# EAGLE design data_proV2.0 - A (EAGLE 8.0.1)
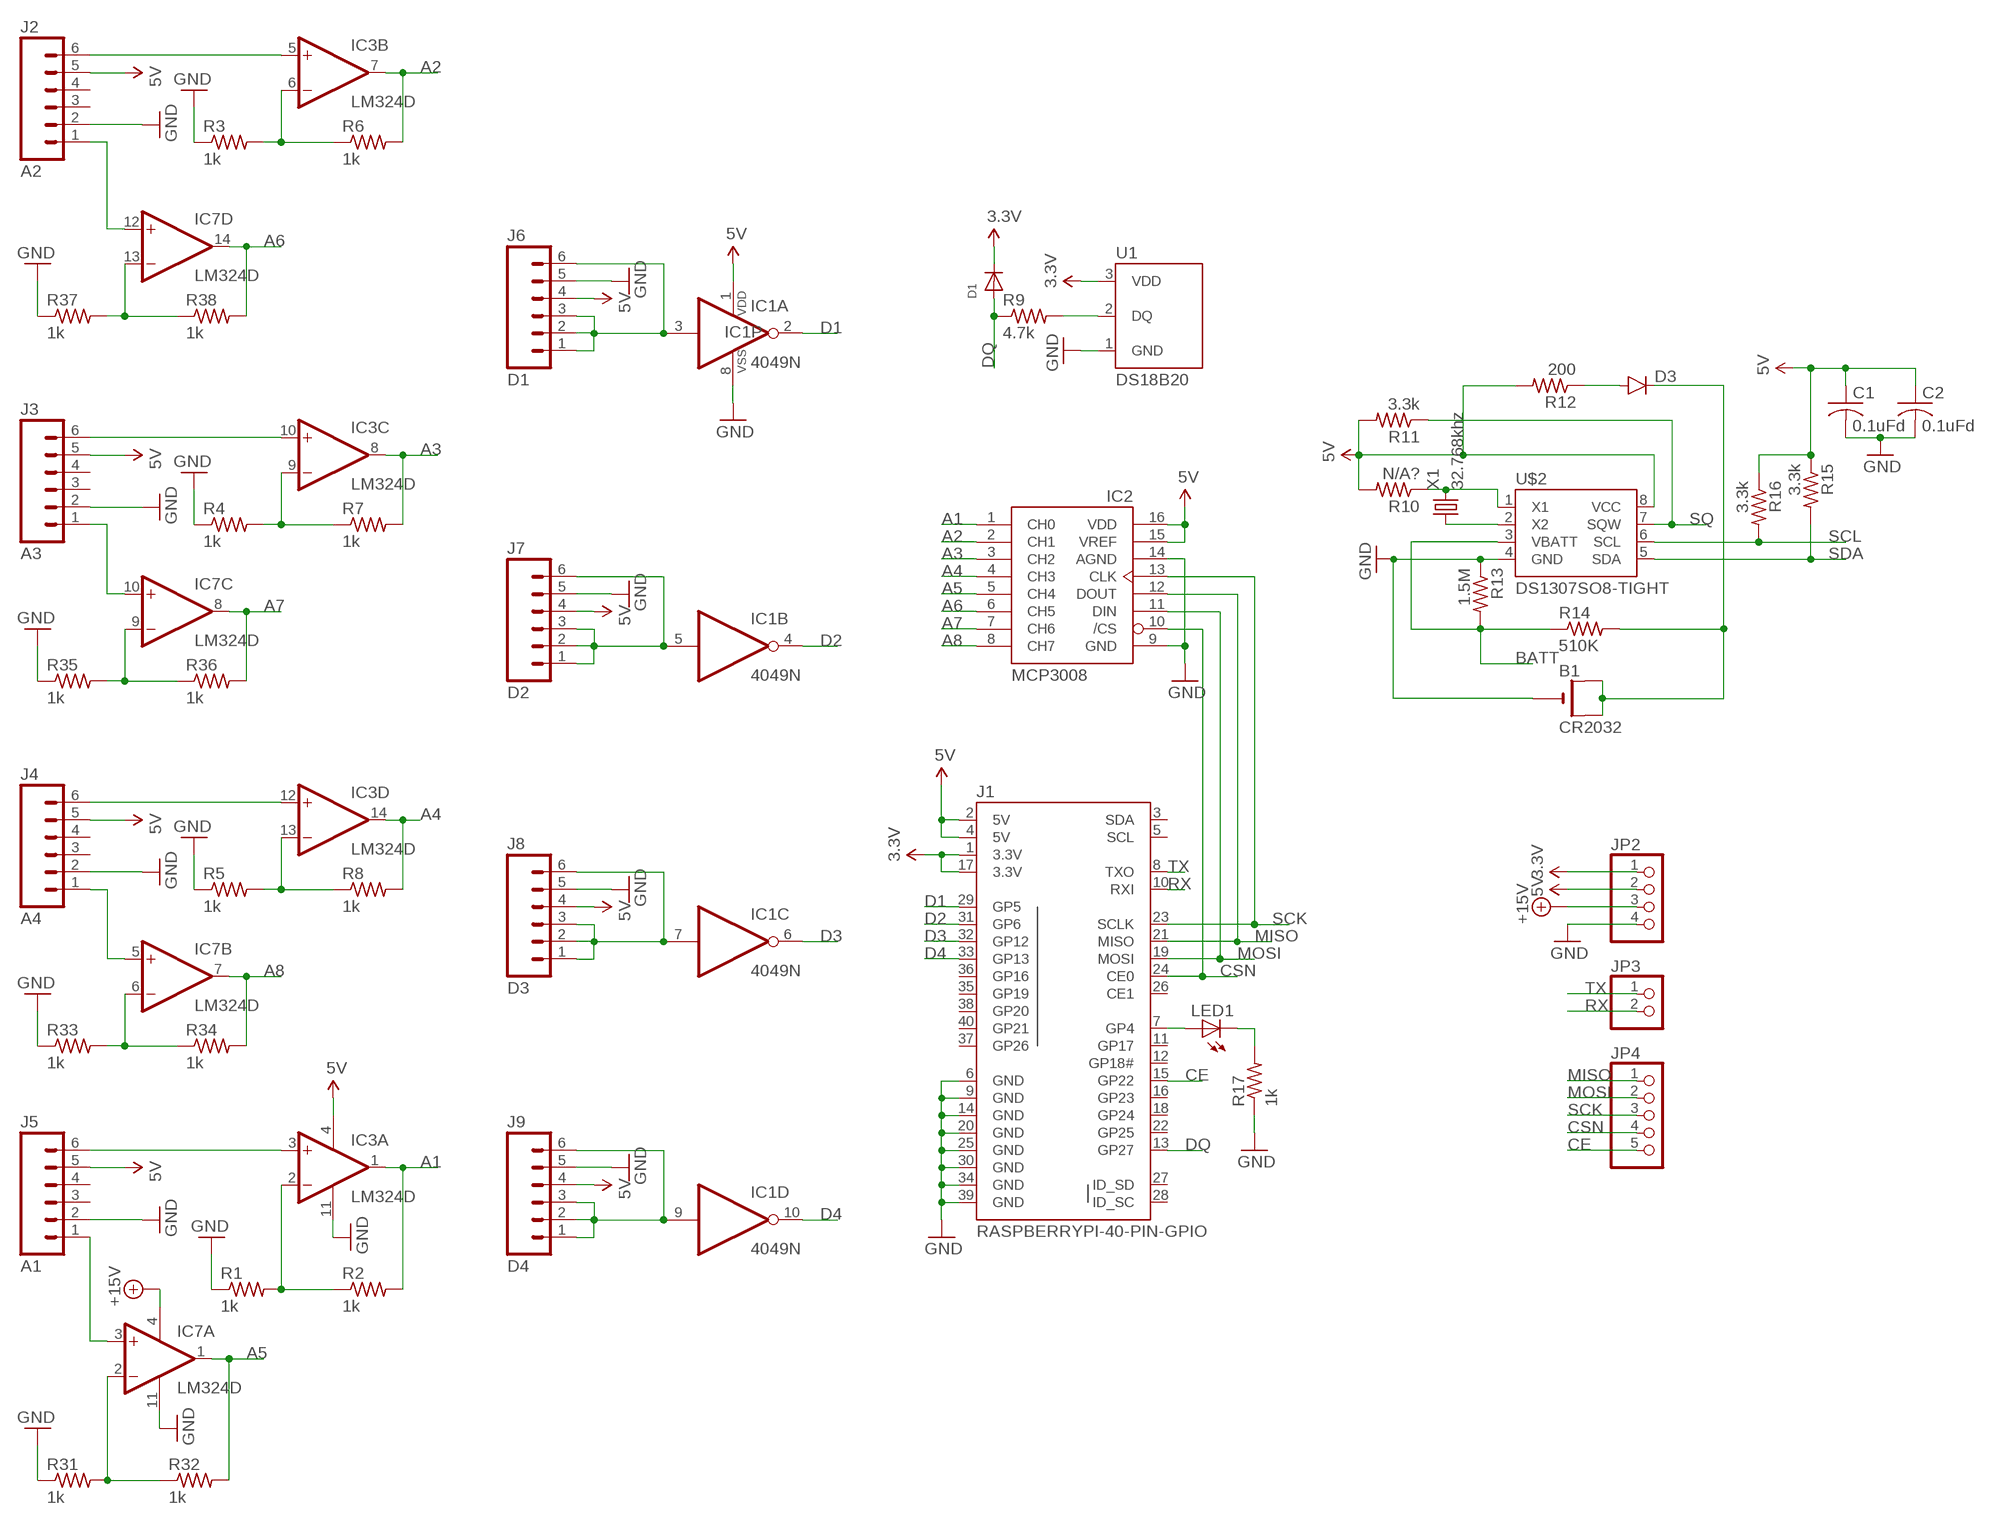
[diagram p0: schematic, sheet 1]

## Parts
B1  CR2032  CR2032SMT  [CR2032-SMD]
C1  0.1uFd  C-USC0805  [C0805]
C2  0.1uFd  C-USC0805  [C0805]
D1  DIODESOD-323F  [SOD-323F]
D3  DIODESMB  [SMB-DIODE]
IC1  4049N  [DIL16]
IC2  MCP3008  [DIL16]
IC3  LM324D  [SO14]
IC7  LM324D  [SO14]
J1  RASPBERRYPI-40-PIN-GPIO  [2X20-SHROUDED]
J2  A2  M06VERNIER-ANALOG  [BTA]
J3  A3  M06VERNIER-ANALOG  [BTA]
J4  A4  M06VERNIER-ANALOG  [BTA]
J5  A1  M06VERNIER-ANALOG  [BTA]
J6  D1  M06VERNIER-DIGITAL  [BTD]
J7  D2  M06VERNIER-DIGITAL  [BTD]
J8  D3  M06VERNIER-DIGITAL  [BTD]
J9  D4  M06VERNIER-DIGITAL  [BTD]
JP2  PINHD-1X4  [1X04]
JP3  PINHD-1X2  [1X02]
JP4  PINHD-1X5  [1X05]
LED1  LEDCHIP-LED0805  [CHIP-LED0805]
R1  1k  R-US_R0805  [R0805]
R2  1k  R-US_R0805  [R0805]
R3  1k  R-US_R0805  [R0805]
R4  1k  R-US_R0805  [R0805]
R5  1k  R-US_R0805  [R0805]
R6  1k  R-US_R0805  [R0805]
R7  1k  R-US_R0805  [R0805]
R8  1k  R-US_R0805  [R0805]
R9  4.7k  R-US_R0805  [R0805]
R10  N/A?  R-US_R0805  [R0805]
R11  3.3k  R-US_R0805  [R0805]
R12  200  R-US_R0805  [R0805]
R13  1.5M  R-US_R0805  [R0805]
R14  510K  R-US_R0805  [R0805]
R15  3.3k  R-US_R0805  [R0805]
R16  3.3k  R-US_R0805  [R0805]
R17  1k  R-US_R0805  [R0805]
R31  1k  R-US_R0805  [R0805]
R32  1k  R-US_R0805  [R0805]
R33  1k  R-US_R0805  [R0805]
R34  1k  R-US_R0805  [R0805]
R35  1k  R-US_R0805  [R0805]
R36  1k  R-US_R0805  [R0805]
R37  1k  R-US_R0805  [R0805]
R38  1k  R-US_R0805  [R0805]
U1  DS18B20  [TO-92-AMMO]
U$2  DS1307SO8-TIGHT  [SO08-TIGHT]
X1  32.768khz  CRYSTALTC38H  [TC38H]

## Nets
3.3V: D1.C J1.1(3.3V) J1.17(3.3V) JP2.1 U1.3(VDD)
5V: C1.1 C2.1 IC1.1(P:VDD) IC2.15(VREF) IC2.16(VDD) IC3.4(P:V+) J1.2(5V) J1.4(5V) J2.5 J3.5 J4.5 J5.5 J6.4 J7.4 J8.4 J9.4 JP2.2 R10.2 R11.2 R12.2 R15.1 R16.1 U$2.8(VCC)
+15V: IC7.4(P:V+) JP2.3
A1: IC2.1(CH0) IC3.1(A:OUT) R2.2
A2: IC2.2(CH1) IC3.7(B:OUT) R6.2
A3: IC2.3(CH2) IC3.8(C:OUT) R7.2
A4: IC2.4(CH3) IC3.14(D:OUT) R8.2
A5: IC2.5(CH4) IC7.1(A:OUT) R32.2
A6: IC2.6(CH5) IC7.14(D:OUT) R38.2
A7: IC2.7(CH6) IC7.8(C:OUT) R36.2
A8: IC2.8(CH7) IC7.7(B:OUT) R34.2
BATT: R13.2 R14.1 U$2.3(VBATT)
CE: J1.15(GP22) JP4.5
CSN: IC2.10(/CS) J1.24(CE0) JP4.4
D1: IC1.2(A:O) J1.29(GP5)
D2: IC1.4(B:O) J1.31(GP6)
D3: IC1.6(C:O) J1.32(GP12)
D4: IC1.10(D:O) J1.33(GP13)
DQ: D1.A J1.13(GP27) R9.1
GND: B1.- C1.2 C2.2 IC1.8(P:VSS) IC2.9(GND) IC2.14(AGND) IC3.11(P:V-) IC7.11(P:V-) J1.6(GND) J1.9(GND) J1.14(GND) J1.20(GND) J1.25(GND) J1.30(GND) J1.34(GND) J1.39(GND) J2.2 J3.2 J4.2 J5.2 J6.5 J7.5 J8.5 J9.5 JP2.4 R1.1 R3.1 R4.1 R5.1 R13.1 R17.1 R31.1 R33.1 R35.1 R37.1 U1.1(GND) U$2.4(GND)
MISO: IC2.12(DOUT) J1.21(MISO) JP4.1
MOSI: IC2.11(DIN) J1.19(MOSI) JP4.2
N$1: U$2.2(X2) X1.1
N$2: R10.1 U$2.1(X1) X1.2
N$3: B1.+$1(+) B1.+$2(+1) D3.C R14.2
N$4: J1.7(GP4) LED1.A
N$5: IC3.2(A:-IN) R1.2 R2.1
N$6: R9.2 U1.2(DQ)
N$7: IC3.13(D:-IN) R5.2 R8.1
N$8: IC3.6(B:-IN) R3.2 R6.1
N$10: D3.A R12.1
N$11: IC1.3(A:I) J6.1 J6.2 J6.3 J6.6
N$12: IC1.5(B:I) J7.1 J7.2 J7.3 J7.6
N$14: IC1.7(C:I) J8.1 J8.2 J8.3 J8.6
N$15: IC1.9(D:I) J9.1 J9.2 J9.3 J9.6
N$16: IC3.9(C:-IN) R4.2 R7.1
N$17: LED1.C R17.2
N$30: IC3.3(A:+IN) J5.6
N$31: IC7.2(A:-IN) R31.2 R32.1
N$32: IC7.3(A:+IN) J5.1
N$33: IC7.6(B:-IN) R33.2 R34.1
N$34: IC7.9(C:-IN) R35.2 R36.1
N$35: IC7.13(D:-IN) R37.2 R38.1
N$36: IC7.12(D:+IN) J2.1
RX: J1.10(RXI) JP3.2
S1-5V1: IC3.5(B:+IN) J2.6
S1-5V2: IC3.10(C:+IN) J3.6
S1-5V3: IC7.5(B:+IN) J4.1
S1-5V4: IC3.12(D:+IN) J4.6
S1-5V5: IC7.10(C:+IN) J3.1
SCK: IC2.13(CLK) J1.23(SCLK) JP4.3
SCL: R16.2 U$2.6(SCL)
SDA: R15.2 U$2.5(SDA)
SQ: R11.1 U$2.7(SQW)
TX: J1.8(TXO) JP3.1
Unconnected: IC1.11(E:I) IC1.12(E:O) IC1.14(F:I) IC1.15(F:O) J1.3(SDA) J1.5(SCL) J1.11(GP17) J1.12(GP18#) J1.16(GP23) J1.18(GP24) J1.22(GP25) J1.26(CE1) J1.27(ID_SD) J1.28(ID_SC) J1.35(GP19) J1.36(GP16) J1.37(GP26) J1.38(GP20) J1.40(GP21) J2.3 J2.4 J3.3 J3.4 J4.3 J4.4 J5.3 J5.4

## Library data of the parts
B1 = adafruit:CR2032
C1 C2 = resistor:C-US: CAPACITOR, American symbol
D1 = adafruit:DIODE: Diode
D3 = SparkFun-DiscreteSemi:DIODE: Diode; PROD_ID: DIO-09646
IC1 = 40xx:4049: Hex inverting BUFFER
IC2 = adafruit:MCP3008
IC3 IC7 = linear:LM324: OP AMP
J1 = SparkFun-Boards:RASPBERRYPI-40-PIN-GPIO: Second Generation Raspberry Pi GPIO Header 2x20 pin connector, as found on B, B+, A+ models.
J2-J9 = SparkFun-Connectors:M06: Header 6 Standard 6-pin 0.1" header. Use with straight break away headers (SKU : PRT-00116), right angle break away headers (PRT-00553), swiss pins (PRT-00743), machine pins (PRT-00117), and female headers (PRT-00115). Molex polarized connector foot print use with SKU : PRT-08094 with associated crimp pins and housings. NOTES ON THE VARIANTS LOCK and LOCK_LONGPADS... This footprint was designed to help hold the alignment of a through-hole component (i.e. 6-pin header) while soldering it into place. You may notice that each hole has been shifted either up or down by 0.005 of an inch from it's more standard position (which is a perfectly straight line). This slight alteration caused the pins (the squares in the middle) to touch the edges of the holes. Because they are alternating, it causes a "brace" to hold the component in place. 0.005 has proven to be the perfect amount of "off-center" position when using our standard breakaway headers. Although looks a little odd when you look at the bare footprint, once you have a header in there, the alteration is very hard to notice. Also,if you push a header all the way into place, it is covered up entirely on the bottom side. This idea of altering the position of holes to aid alignment will be further integrated into the Sparkfun Library for other footprints. It can help hold any component with 3 or more connection pins.
JP2 = pinhead:PINHD-1X4: PIN HEADER
JP3 = pinhead:PINHD-1X2: PIN HEADER
JP4 = pinhead:PINHD-1X5: PIN HEADER
LED1 = led:LED: LED OSRAM: - CHIPLED LG R971, LG N971, LY N971, LG Q971, LY Q971, LO R971, LY R971 LH N974, LH R974 LS Q976, LO Q976, LY Q976 LO Q996 - Hyper CHIPLED LW Q18S LB Q993, LB Q99A, LB R99A - SideLED LS A670, LO A670, LY A670, LG A670, LP A670 LB A673, LV A673, LT A673, LW A673 LH A674 LY A675 LS A676, LA A676, LO A676, LY A676, LW A676 LS A679, LY A679, LG A679 - Hyper Micro SIDELED® LS Y876, LA Y876, LO Y876, LY Y876 LT Y87S - SmartLED LW L88C, LW L88S LB L89C, LB L89S, LG L890 LS L89K, LO L89K, LY L89K LS L896, LA L896, LO L896, LY L896 - TOPLED LS T670, LO T670, LY T670, LG T670, LP T670 LSG T670, LSP T670, LSY T670, LOP T670, LYG T670 LG T671, LOG T671, LSG T671 LB T673, LV T673, LT T673, LW T673 LH T674 LS T676, LA T676, LO T676, LY T676, LB T676, LH T676, LSB T676, LW T676 LB T67C, LV T67C, LT T67C, LS T67K, LO T67K, LY T67K, LW E67C LS E67B, LA E67B, LO E67B, LY E67B, LB E67C, LV E67C, LT E67C LW T67C LS T679, LY T679, LG T679 LS T770, LO T770, LY T770, LG T770, LP T770 LB T773, LV T773, LT T773, LW T773 LH T774 LS E675, LA E675, LY E675, LS T675 LS T776, LA T776, LO T776, LY T776, LB T776 LHGB T686 LT T68C, LB T68C - Hyper Mini TOPLED® LB M676 - Mini TOPLED Santana® LG M470 LS M47K, LO M47K, LY M47K Source: http://www.osram.convergy.de LUXEON: - LUMILED® LXK2-PW12-R00, LXK2-PW12-S00, LXK2-PW14-U00, LXK2-PW14-V00 LXK2-PM12-R00, LXK2-PM12-S00, LXK2-PM14-U00 LXK2-PE12-Q00, LXK2-PE12-R00, LXK2-PE12-S00, LXK2-PE14-T00, LXK2-PE14-U00 LXK2-PB12-K00, LXK2-PB12-L00, LXK2-PB12-M00, LXK2-PB14-N00, LXK2-PB14-P00, LXK2-PB14-Q00 LXK2-PR12-L00, LXK2-PR12-M00, LXK2-PR14-Q00, LXK2-PR14-R00 LXK2-PD12-Q00, LXK2-PD12-R00, LXK2-PD12-S00 LXK2-PH12-R00, LXK2-PH12-S00 LXK2-PL12-P00, LXK2-PL12-Q00, LXK2-PL12-R00 Source: www.luxeon.com KINGBRIGHT: KA-3528ASYC Source: www.kingbright.com
R1-R9 R31-R38 = resistor:R-US_: RESISTOR, American symbol
R10-R17 = adafruit:R-US_: RESISTOR, American symbol
U1 = SparkFun-Sensors:DS18B20: Dallas/Maxim DS18B20 1-wire temperature sensor Datasheet: http://datasheets.maximintegrated.com/en/ds/DS18B20.pdf temp thermometer 1-wire one-wire one wire; STORE_ID: SEN-00245
U$2 = SparkFun-FreqCtrl:DS1307: I2C real-time clock with battery backup.; PROD_ID: IC-08138
X1 = crystal:CRYSTAL: CRYSTAL; OC_FARNELL: unknown; OC_NEWARK: unknown

## Board
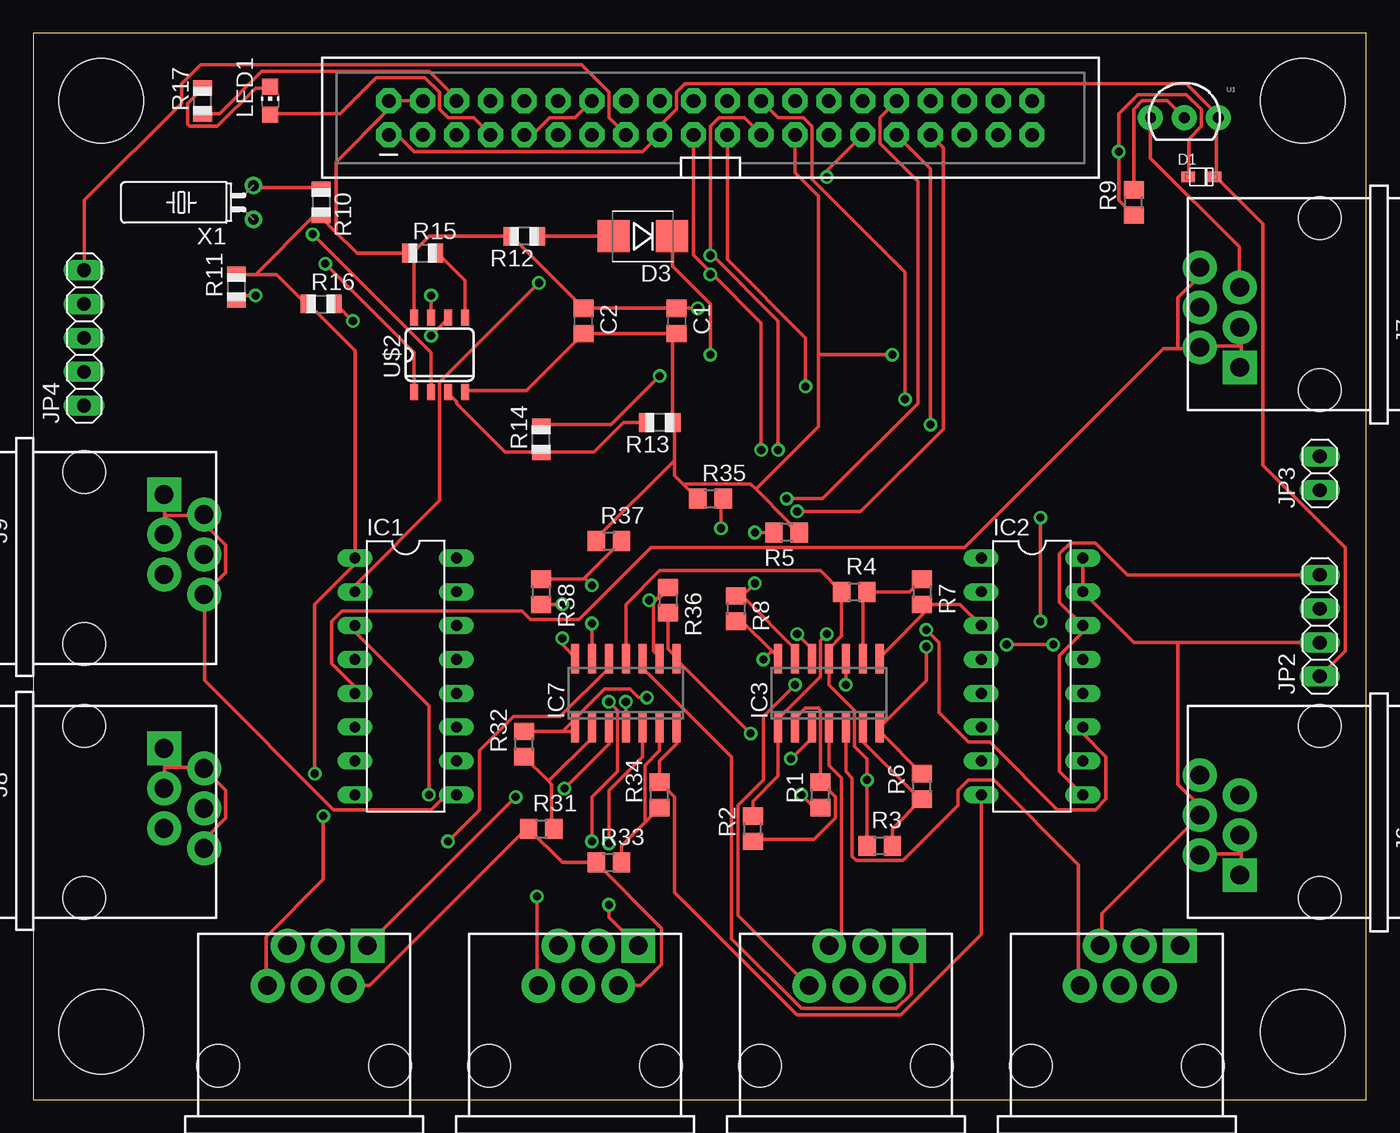
[diagram p1: board, top side]
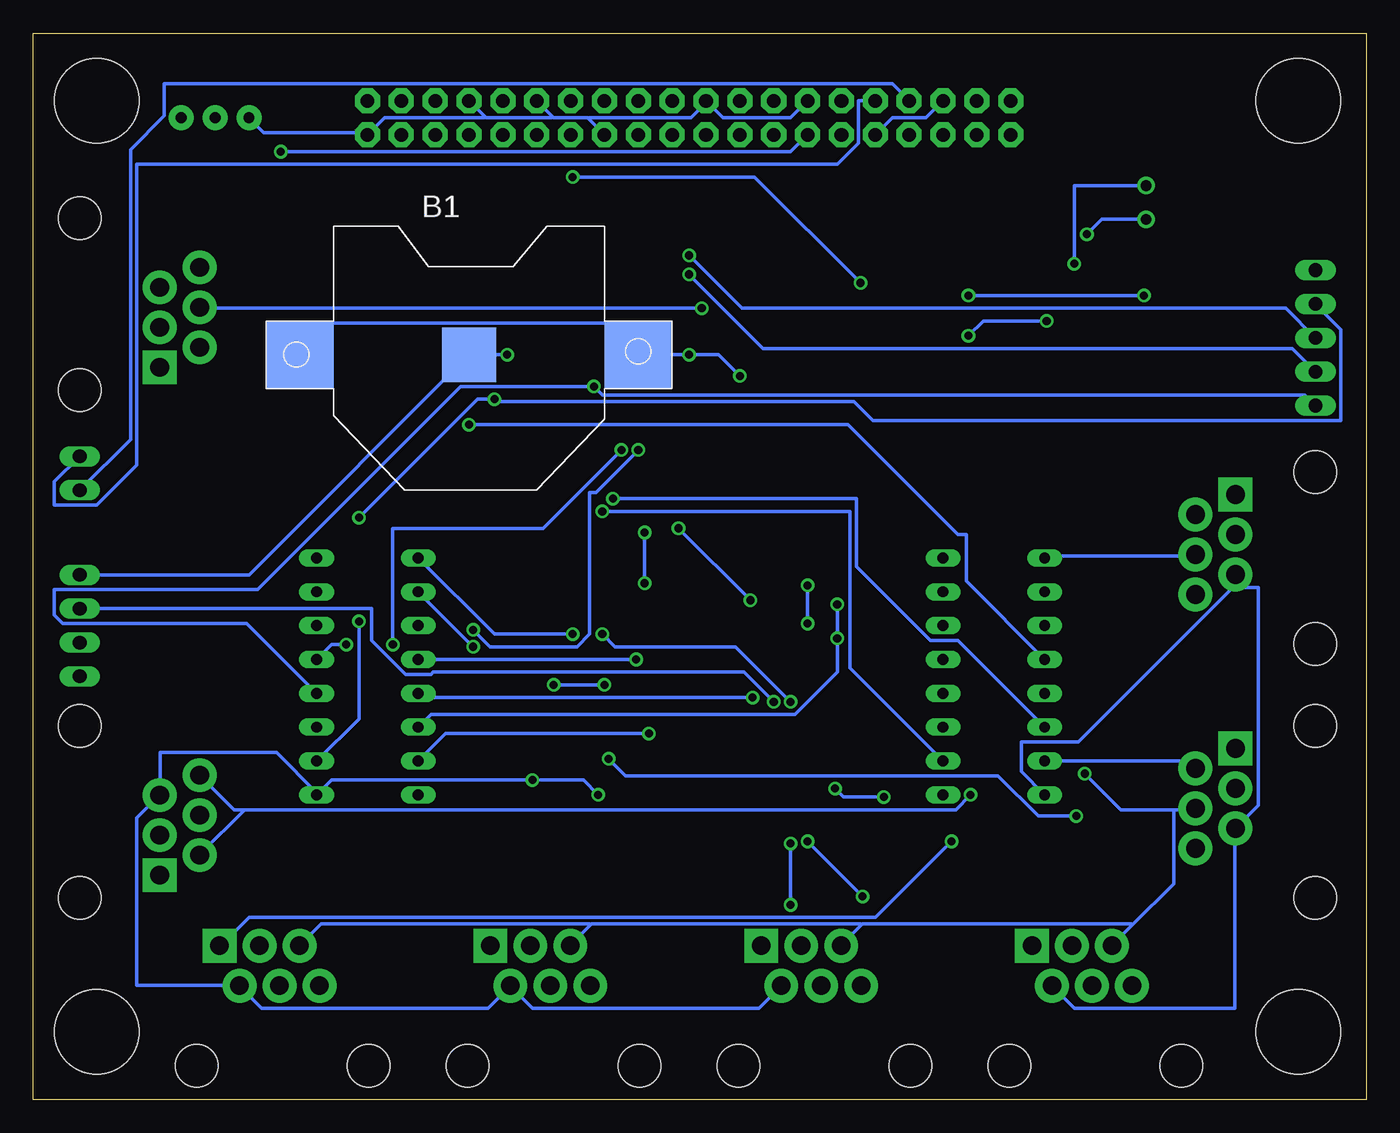
[diagram p2: board, bottom side, seen from below]

Size 100 x 80 mm. Coordinates in mm from the lower left corner, seen from the top.
Outline: 0,0 100,0 100,80 0,80 0,0
Copper layers (1*16): Top 0.035mm / dielectric 1.5mm / Bottom 0.035mm
Design rules "default": minimum track width 10mil, minimum drill 24mil, track to track 8mil, track to pad 8mil, pad to pad 8mil, via to via 8mil, smd to smd 8mil, copper to edge 40mil, drill to drill 8mil, minimum pad ring 10mil, minimum via ring 8mil, stop-mask expansion 4mil, vias tented up to drill 0mil, thermal gap 10mil
Holes 6.35 mm at 5.08,5.08 95.25,5.08 95.25,74.93 5.08,74.93

### Footprints (pad centres in the part's own frame; a part is rotated, then mirrored left to right if it is on the bottom)
CR2032-SMD = smd 5.08 x 5.08: +$1 -12.7,0; +$2 12.7,0 | smd 4.064 x 4.064: - 0,0
C0805 = smd 1.3 x 1.5: 1 -0.95,0; 2 0.95,0
SOD-323F = smd 1 x 0.8: A -1,0; C 1,0
SMB-DIODE = smd 2.4 x 2.4: A 2.2,0; C -2.2,0
DIL16 = drill 0.813 long: 1 -8.89,-3.81; 2 -6.35,-3.81; 3 -3.81,-3.81; 4 -1.27,-3.81; 5 1.27,-3.81; 6 3.81,-3.81; 7 6.35,-3.81; 8 8.89,-3.81; 9 8.89,3.81; 10 6.35,3.81; 11 3.81,3.81; 12 1.27,3.81; 13 -1.27,3.81; 14 -3.81,3.81; 15 -6.35,3.81; 16 -8.89,3.81
SO14 = smd 0.6 x 2.2: 1 -3.81,-2.6; 2 -2.54,-2.6; 3 -1.27,-2.6; 4 0,-2.6; 5 1.27,-2.6; 6 2.54,-2.6; 7 3.81,-2.6; 8 3.81,2.6; 9 2.54,2.6; 10 1.27,2.6; 11 0,2.6; 12 -1.27,2.6; 13 -2.54,2.6; 14 -3.81,2.6
2X20-SHROUDED = drill 1.016 pad 1.88 octagon: 1 -1.27,24.13; 2 1.27,24.13; 3 -1.27,21.59; 4 1.27,21.59; 5 -1.27,19.05; 6 1.27,19.05; 7 -1.27,16.51; 8 1.27,16.51; 9 -1.27,13.97; 10 1.27,13.97; 11 -1.27,11.43; 12 1.27,11.43; 13 -1.27,8.89; 14 1.27,8.89; 15 -1.27,6.35; 16 1.27,6.35; 17 -1.27,3.81; 18 1.27,3.81; 19 -1.27,1.27; 20 1.27,1.27; 21 -1.27,-1.27; 22 1.27,-1.27; 23 -1.27,-3.81; 24 1.27,-3.81; 25 -1.27,-6.35; 26 1.27,-6.35; 27 -1.27,-8.89; 28 1.27,-8.89; 29 -1.27,-11.43; 30 1.27,-11.43; 31 -1.27,-13.97; 32 1.27,-13.97; 33 -1.27,-16.51; 34 1.27,-16.51; 35 -1.27,-19.05; 36 1.27,-19.05; 37 -1.27,-21.59; 38 1.27,-21.59; 39 -1.27,-24.13; 40 1.27,-24.13
BTA = drill 1.4 pad 2.54 square: 1 4.75,9 | drill 1.4 pad 2.54: 2 3.25,6; 3 1.75,9; 4 0.25,6; 5 -1.25,9; 6 -2.75,6 | hole 3.2: 6.45,0; -6.45,0
BTD = drill 1.4 pad 2.54 square: 1 -4.75,6 | drill 1.4 pad 2.54: 2 -3.25,9; 3 -1.75,6; 4 -0.25,9; 5 1.25,6; 6 2.75,9 | hole 3.2: 6.45,0; -6.45,0
1X04 = drill 1.016 long: 1 -3.81,0; 2 -1.27,0; 3 1.27,0; 4 3.81,0
1X02 = drill 1.016 long: 1 -1.27,0; 2 1.27,0
1X05 = drill 1.016 long: 1 -5.08,0; 2 -2.54,0; 3 0,0; 4 2.54,0; 5 5.08,0
CHIP-LED0805 = smd 1.2 x 1.2: A 0,-1.05; C 0,1.05
R0805 = smd 1.3 x 1.5: 1 -0.95,0; 2 0.95,0
R0805' = smd 1.1 x 1.4: 1 -1,0; 2 1,0
TO-92-AMMO = drill 0.813 pad 1.88: 1 -2.54,0; 2 0,0; 3 2.54,0
SO08-TIGHT = smd 0.6 x 1.2: 1 -1.905,-2.8; 2 -0.635,-2.8; 3 0.635,-2.8; 4 1.905,-2.8; 5 1.905,2.8; 6 0.635,2.8; 7 -0.635,2.8; 8 -1.905,2.8
TC38H = drill 0.813: 1 -1.27,0; 2 1.27,0

### Placement (x,y rotation side)
B1  67.31,55.88 0 bottom
C1  48.26,58.42 270 top
C2  41.27,58.42 270 top
D1  87.63,69.22 0 top
D3  45.72,64.77 180 top
IC1  27.94,31.75 270 top
IC2  74.93,31.75 270 top
IC3  59.69,30.48 0 top
IC7  44.45,30.48 0 top
J1  50.8,73.66 90 top
J2  81.28,2.54 0 top
J3  60.96,2.54 0 top
J4  40.64,2.54 0 top
J5  20.32,2.54 0 top
J6  96.52,21.59 90 top
J7  96.52,59.69 90 top
J8  3.81,21.59 270 top
J9  3.81,40.64 270 top
JP2  96.52,35.56 90 top
JP3  96.52,46.99 90 top
JP4  3.81,57.15 90 top
LED1  17.78,74.93 0 top
R1  59.05,22.86 90 top
R2  53.98,20.32 90 top
R3  63.5,19.05 0 top
R4  61.59,38.1 0 top
R5  56.52,42.55 180 top
R6  66.67,23.5 90 top
R7  66.67,38.1 270 top
R8  52.7,36.83 270 top
R9  82.55,67.31 90 top
R10  N/A?  [R0805']  21.59,67.31 270 top
R11  3.3k  [R0805']  15.24,60.96 90 top
R12  200  [R0805']  36.83,64.77 180 top
R13  1.5M  [R0805']  46.99,50.8 180 top
R14  510K  [R0805']  38.1,49.53 90 top
R15  3.3k  [R0805']  29.21,63.5 0 top
R16  3.3k  [R0805']  21.59,59.69 0 top
R17  1k  [R0805']  12.7,74.93 90 top
R31  38.1,20.32 0 top
R32  36.83,26.67 90 top
R33  43.18,17.78 0 top
R34  46.99,22.86 90 top
R35  50.8,45.09 0 top
R36  47.62,37.47 270 top
R37  43.18,41.91 0 top
R38  38.1,38.1 270 top
U1  86.36,73.66 0 top
U$2  30.48,55.88 0 top
X1  16.51,67.31 90 top

### Tracks (layer width: path | path; a pad name or v marks a point on that pad's centre or on a via)
3.3V
  Top 0.254: J1.1 27.3,72.39 28.57,71.12 45.72,71.12 J1.17 46.99,73.03 48.26,74.3 48.26,75.56 48.9,76.2 86.52,76.2 88.74,73.98 88.74,73.66 U1.3 88.74,73.5 88.74,69.22 | JP2.1 98.42,33.66 98.42,41.43 92.23,47.62 92.23,65.72 88.74,69.22 | 88.74,69.22 D1.C
5V  (via drill 0.61)
  Top 0.254: J1.4 J1.2 26.67,74.3 22.7,70.33 22.7,65.25 22.62,65.17 | U$2.8 28.57,63.18 28.26,63.5 R15.1 | 16.67,61.91 18.26,61.91 20.48,59.69 R16.1 20.64,59.69 24.13,56.2 IC1.1 24.13,40.16 21.11,37.15 v21.11,24.45 | 16.67,61.91 15.24,61.91 R11.2 | 21.59,66.2 20.95,66.2 16.67,61.91 | R15.1 24.29,63.5 22.62,65.17 | 21.59,66.2 22.62,65.17 | 21.59,66.2 R10.2 | C2.1 35.88,64.77 R12.2 29.69,64.77 28.42,63.5 R15.1 | C2.1 C1.1 | C2.1 | C1.1 v49.85,59.37 | C1.1 | J2.5 80.17,11.59 80.17,13.97 87.47,21.27 J6.4 87.47,21.43 87.47,22.07 85.88,23.65 85.88,34.29 | IC2.16 IC2.15 82.55,34.29 85.88,34.29 | 85.88,34.29 JP2.2 | IC3.4 59.69,25.08 60.64,24.13 60.64,12.38 59.85,11.59 J3.5
  Bottom 0.254: IC1.1 23.97,40.8 12.86,40.8 J9.4 | v49.85,59.37 87.47,59.37 J7.4 | 17.54,13.1 14.45,16.19 14.45,21.75 | 17.54,13.1 19.05,11.59 J5.5 | 14.45,21.75 12.86,21.75 J8.4 | 37.86,13.1 37.78,13.18 17.62,13.18 17.54,13.1 | 37.86,13.1 39.37,11.59 J4.5 | 58.18,13.1 58.1,13.18 37.94,13.18 37.86,13.1 | 58.18,13.1 59.69,11.59 J3.5 | J2.5 80.01,11.59 78.42,13.18 58.26,13.18 58.18,13.1 | v21.11,24.45 18.41,21.75 14.45,21.75
+15V  (via drill 0.61)
  Top 0.254: v44.45,29.84 IC7.4
  Bottom 0.254: v44.45,29.84 46.67,32.07 70.01,32.07 70.17,31.91 72.07,31.91 74.61,34.45 74.61,36.83 JP2.3
A1  (via drill 0.61)
  Top 0.254: R2.2 53.98,22.38 55.88,24.29 IC3.1 55.88,28.57 59.05,31.75 59.05,34.45 v59.53,34.92
  Bottom 0.254: IC2.1 65.41,34.92 v59.53,34.92
A2  (via drill 0.61)
  Top 0.254: R6.2 63.5,27.62 IC3.7 63.5,27.94 66.99,31.43 v66.99,33.97
  Bottom 0.254: v66.99,33.97 IC2.2
A3
  Top 0.254: 67.47,37.15 69.53,37.15 IC2.3 | 67.47,37.15 R7.2 | 67.47,37.15 63.5,33.18 IC3.8
A4  (via drill 0.61)
  Top 0.254: 55.4,33.66 55.88,33.18 IC3.14 | 55.4,33.66 53.18,35.88 R8.2 | 55.4,33.66 v54.77,33.02
  Bottom 0.254: v54.77,33.02 IC2.4
A5  (via drill 0.61)
  Top 0.254: 39.69,27.62 40.48,27.62 40.64,27.78 IC7.1 | 39.69,27.62 R32.2 | v46.04,30.16 45.4,30.16 44.77,30.8 42.86,30.8 39.69,27.62
  Bottom 0.254: IC2.5 70.8,30.16 v46.04,30.16
A6  (via drill 0.61)
  Top 0.254: v39.69,37.15 R38.2 | v39.69,34.61 39.69,34.13 40.64,33.18 IC7.14
  Bottom 0.254: v39.69,37.15 v39.69,34.61 39.69,32.07 42.86,28.89 70.17,28.89 IC2.6
A7  (via drill 0.61)
  Top 0.254: R36.2 47.62,33.81 48.26,33.18 IC7.8 48.26,33.02 v53.82,27.46
  Bottom 0.254: IC2.7 69.06,27.46 v53.82,27.46
A8
  Top 0.254: R34.2 46.99,25.4 48.26,26.67 IC7.7 | IC2.8 71.12,12.38 65.09,6.35 57.31,6.35 48.1,15.56 48.1,22.7 R34.2 | R34.2
BATT
  Top 0.254: 38.1,48.58 35.4,48.58 31.75,52.23 31.75,52.39 31.11,53.02 U$2.3 | R13.2 44.29,50.8 42.07,48.58 38.1,48.58 | 38.1,48.58 R14.1
CE
  Top 0.254: JP4.5 3.81,67.47 11.11,74.77 11.11,76.2 12.54,77.63 41.12,77.63 43.18,75.56 43.18,73.66 J1.15
CSN  (via drill 0.61)
  Top 0.254: v75.56,43.66 v75.56,35.88 | v65.41,52.55 65.41,62.07 58.42,69.06 58.42,73.03 57.78,73.66 55.88,73.66 J1.24
  Bottom 0.254: IC2.10 75.56,28.57 v75.56,35.88 | v75.56,43.66 66.67,52.55 v65.41,52.55 65.25,52.39 38.42,52.39 36.99,50.96 1.91,50.96 1.91,57.78 JP4.4
D1  (via drill 0.61)
  Top 0.254: IC1.2 24.13,38.58 30.48,44.93 30.48,53.82 v37.94,61.28 | v59.53,69.22 59.53,69.69 J1.29
  Bottom 0.254: v37.94,61.28 45.88,69.22 v59.53,69.22
D2  (via drill 0.61)
  Top 0.254: v67.31,50.64 67.31,69.85 J1.31
  Bottom 0.254: IC1.4 30,38.89 30,42.39 30.64,42.39 38.89,50.64 v67.31,50.64
D3  (via drill 0.61)
  Top 0.254: v56.52,45.09 59.21,45.09 66.36,52.23 66.36,68.9 63.5,71.75 63.5,73.66 J1.32
  Bottom 0.254: IC1.6 30.64,34.45 32.7,34.45 38.26,40.01 38.26,45.09 v56.52,45.09
D4  (via drill 0.61)
  Top 0.254: v57.31,44.13 62.07,44.13 68.26,50.32 68.26,71.44 J1.33
  Bottom 0.254: IC1.10 38.73,32.38 38.73,44.13 v57.31,44.13
DQ  (via drill 0.61)
  Top 0.254: D1.A 86.68,69.22 86.68,72.07 87.63,73.03 87.63,74.3 86.52,75.41 82.87,75.41 81.44,73.98 v81.44,71.12 81.44,67.47 R9.1
  Bottom 0.254: J1.13 43.18,71.12 v81.44,71.12
GND  (via drill 0.61)
  Top 0.254: C2.2 36.99,53.18 32.38,53.18 U$2.4 | C2.2 47.94,57.47 | 47.94,57.47 C1.2 47.94,57.47 | C2.2 | 48.1,47.94 48.1,46.83 48.82,46.12 | 48.1,47.94 48.1,50.8 R13.1 47.94,50.8 47.94,57.47 | 48.82,46.12 R35.1 | 48.1,47.94 42.39,42.23 42.39,41.91 R37.1 | 54.21,45.8 53.82,46.2 48.9,46.2 48.82,46.12 | 54.21,45.8 56.67,43.34 56.67,43.18 57.31,42.55 R5.1 | J1.6 31.75,75.09 29.69,77.15 17.14,77.15 13.97,73.98 12.7,73.98 R17.1 | U1.1 83.82,70.64 90.49,63.98 90.49,60.96 J7.5 | J1.9 37.47,72.39 38.73,73.66 40.64,73.66 J1.14 | 54.21,45.8 58.9,50.48 58.9,55.88 | 58.9,55.88 58.9,67.79 57.15,69.53 J1.25 | R3.1 v62.55,23.97 62.55,25.56 61.59,26.51 61.59,29.21 59.69,31.11 IC3.11 59.69,33.81 60.64,34.77 R4.1 | IC7.11 44.45,37.15 46.99,39.69 59.05,39.69 R4.1 | R4.1 | v57.63,22.86 58.42,22.07 59.05,22.07 R1.1 | IC2.9 76.99,24.61 76.99,33.34 78.74,35.08 IC2.14 76.99,37.31 76.99,40.96 77.79,41.75 79.69,41.75 82.07,39.37 JP2.4 | R33.1 39.69,17.78 R31.1 37.15,20.16 36.83,20.16 25.24,8.57 23.65,8.57 J5.2 | R33.1 47.15,12.86 47.15,10.16 45.56,8.57 43.97,8.57 J4.2 | R33.1 | v64.45,55.88 58.9,55.88
  Bottom 0.254: J1.9 35.56,73.66 33.02,73.66 J1.6 | J1.14 43.18,73.66 48.26,73.66 J1.20 49.53,74.77 50.64,73.66 58.26,73.66 58.34,73.58 | 58.34,73.58 58.42,73.66 60.96,73.66 61.04,73.74 | 58.34,73.58 J1.25 | J1.30 61.04,73.74 | 66.12,73.74 66.04,73.66 61.12,73.66 61.04,73.74 | 66.12,73.74 J1.34 | 66.12,73.74 66.2,73.66 73.66,73.66 J1.39 74.93,72.55 82.71,72.55 U1.1 | v57.63,22.86 58.74,23.97 v62.55,23.97 77.63,23.97 IC2.9 78.74,23.02 81.76,26.04 90.49,26.04 90.49,22.86 J6.5 90.65,22.7 92.23,21.11 92.23,8.57 84.61,8.57 J2.2 84.45,8.41 82.87,6.83 65.88,6.83 64.29,8.41 J3.2 64.14,8.41 62.55,6.83 45.56,6.83 43.97,8.41 J4.2 | JP2.4 83.82,39.37 B1.- v64.45,55.88 | IC1.8 25.88,24.61 25.88,26.83 21.59,26.83 9.84,38.58 9.84,39.37 J9.5 9.84,38.42 8.1,38.42 8.1,22.07 9.68,20.48 J8.5 9.84,20.32 9.84,6.83 21.91,6.83 23.5,8.41 J5.2
MISO  (via drill 0.61)
  Top 0.254: v57.94,53.5 57.94,57.15 52.07,63.02 J1.21
  Bottom 0.254: IC2.12 83.98,35.72 97.79,35.72 98.42,36.35 98.42,38.26 83.19,38.26 67.94,53.5 v57.94,53.5 57.31,52.86 4.6,52.86 JP4.1
MOSI  (via drill 0.61)
  Top 0.254: IC2.11 78.74,27.46 80.49,25.72 80.49,22.54 79.69,21.75 76.83,21.75 71.75,26.83 70.17,26.83 67.94,29.05 67.94,34.29 v66.99,35.24 | v54.61,48.74 54.61,58.26 50.88,61.99 | 50.88,61.99 49.53,63.34 J1.19 | v50.8,61.91 50.88,61.99
  Bottom 0.254: v66.99,35.24 65.72,33.97 59.21,33.97 58.26,34.92 58.26,45.56 57.78,45.56 v54.61,48.74 | JP4.2 5.56,56.36 45.24,56.36 v50.8,61.91
N$1  (via drill 0.61)
  Top 0.254: U$2.2 29.84,56.04 v20.95,64.93
  Bottom 0.254: v20.95,64.93 19.84,66.04 X1.1
N$2  (via drill 0.61)
  Top 0.254: U$2.1 28.57,56.04 v21.91,62.71 | X1.2 16.67,68.42 21.59,68.42 R10.1
  Bottom 0.254: v21.91,62.71 21.91,68.58 X1.2
N$3  (via drill 0.61)
  Top 0.254: v46.99,54.29 43.34,50.64 38.1,50.64 R14.2 | v50.8,55.88 50.8,59.69 47.94,62.55 47.94,64.77 D3.C
  Bottom 0.254: v46.99,54.29 48.58,55.88 v50.8,55.88 B1.+$2 56.99,58.26 77.63,58.26 B1.+$1
N$4
  Top 0.254: J1.7 33.02,73.66 31.11,73.66 30.48,74.3 30.48,75.56 29.37,76.68 25.72,76.68 23.02,73.98 17.78,73.98 LED1.A
N$5
  Top 0.254: R1.2 60.17,22.7 60.17,21.11 58.58,19.53 53.98,19.53 R2.1 | IC3.2 57.15,28.57 57.94,29.37 58.9,29.37 59.05,29.21 R1.2 | R1.2
N$6
  Top 0.254: R9.2 82.55,74.3 83.19,74.93 85.09,74.93 U1.2
N$7  (via drill 0.61)
  Top 0.254: 53.02,37.62 53.34,37.62 57.15,33.81 IC3.13 | 53.02,37.62 52.7,37.62 R8.1 53.02,37.62 | v54.13,42.55 R5.2 | 53.02,37.62 v54.13,38.73
  Bottom 0.254: v54.13,38.73 v54.13,42.55
N$8
  Top 0.254: R3.2 64.45,20.32 R6.1 66.52,22.54 62.23,26.83 IC3.6
N$10
  Top 0.254: D3.A R12.1
N$11  (via drill 0.61)
  Top 0.254: 90.65,18.41 90.65,19.68 J6.3 | 90.65,18.41 90.65,16.99 J6.1 | 90.65,18.41 87.63,18.41 J6.2 | IC1.3 24.13,35.08 29.69,29.53 v29.69,22.86
  Bottom 0.254: v29.69,22.86 30.8,21.75 84.14,21.75 | 84.14,21.75 84.93,21.75 87.47,24.29 J6.6 | 84.14,21.75 87.47,18.41 J6.2
N$12
  Top 0.254: 90.65,56.52 90.65,57.78 J7.3 | 90.65,56.52 90.65,55.09 J7.1 | IC1.5 24.13,30.96 22.38,32.7 22.38,35.88 23.18,36.67 36.67,36.67 37.31,36.04 40.96,36.04 46.35,41.43 69.85,41.43 84.77,56.36 85.88,56.36 | 85.88,56.36 87.47,56.36 J7.2 87.63,56.52 90.65,56.52 | 85.88,56.36 85.88,60.17 87.47,61.75 87.47,62.39 J7.6
N$14
  Top 0.254: 9.84,24.92 9.84,26.19 J8.1 | 9.84,24.92 9.84,23.5 J8.3 | J8.6 12.86,18.89 12.86,19.53 14.45,21.11 14.45,23.18 12.86,24.77 J8.2 12.7,24.92 9.84,24.92
  Bottom 0.254: IC1.7 13.34,25.4 12.86,24.92 J8.2
N$15
  Top 0.254: 9.84,43.81 9.84,45.24 J9.1 | 9.84,43.81 9.84,42.55 J9.3 | 9.84,43.81 12.7,43.81 J9.2 12.86,43.81 12.86,43.18 14.45,41.59 14.45,39.53 12.86,37.94 J9.6 12.86,37.78 12.86,31.43 22.54,21.75 29.84,21.75 30.96,22.86 IC1.9
N$16
  Top 0.254: R7.1 65.72,38.1 R4.2 62.39,38.1 62.23,37.94 IC3.9
N$17
  Top 0.254: LED1.C 17.78,75.88 16.67,75.88 13.81,73.03 11.75,73.03 11.59,73.18 11.59,74.77 12.7,75.88 R17.2
N$30  (via drill 0.61)
  Top 0.254: IC3.3 58.42,27.15 v56.83,25.56 | v21.75,21.27 21.75,16.51 17.46,12.22 17.46,8.57 J5.6
  Bottom 0.254: v56.83,25.56 55.56,24.29 27.62,24.29 24.61,21.27 v21.75,21.27
N$31
  Top 0.254: 38.66,23.89 R32.1 | 38.66,23.89 38.89,23.65 38.89,20.32 R31.2 | IC7.2 41.91,27.15 38.66,23.89
N$32  (via drill 0.61)
  Top 0.254: IC7.3 43.18,26.67 v39.85,23.34 | v36.2,22.7 25.08,11.59 J5.1
  Bottom 0.254: v39.85,23.34 39.21,22.7 v36.2,22.7
N$33
  Top 0.254: 45.96,20.88 R34.1 | 45.96,20.88 44.13,19.05 R33.2 | IC7.6 46.99,26.19 45.88,25.08 45.88,20.95 45.96,20.88
N$34  (via drill 0.61)
  Top 0.254: 46.59,37.39 46.51,37.31 46.51,33.66 46.99,33.18 IC7.9 | 46.59,37.39 46.83,37.62 46.99,37.62 47.62,38.26 R36.1 | v51.59,42.86 51.59,45.09 R35.2 | v46.2,37.47 46.51,37.47 46.59,37.39
  Bottom 0.254: v46.2,37.47 v51.59,42.86
N$35  (via drill 0.61)
  Top 0.254: 41.35,39.13 R37.2 | 41.35,39.13 41.27,39.05 R38.1 | v41.91,35.72 IC7.13 | 41.35,39.13 v41.91,38.58
  Bottom 0.254: v41.91,38.58 v41.91,35.72
N$36  (via drill 0.61)
  Top 0.254: IC7.12 43.18,32.38 39.53,28.73 36.04,28.73 33.5,26.19 33.5,21.75 v31.11,19.37
  Bottom 0.254: v31.11,19.37 36.83,13.65 83.82,13.65 85.88,11.59 J2.1
RX
  Bottom 0.254: JP3.2 98.42,46.35 98.42,44.61 95.25,44.61 92.23,47.62 92.23,70.17 39.69,70.17 38.1,71.75 38.1,74.93 J1.10
S1-5V1
  Top 0.254: IC3.5 60.96,24.61 61.44,24.13 61.44,18.26 61.75,17.94 65.25,17.94 69.37,22.07 69.37,23.18 70.17,23.97 72.07,23.97 78.42,17.62 78.42,8.57 J2.6
S1-5V2  (via drill 0.61)
  Top 0.254: v60.96,31.11 IC3.10 | v57.15,31.11 54.77,28.73 54.77,23.97 52.86,22.07 52.86,13.81 58.1,8.57 J3.6
  Bottom 0.254: v57.15,31.11 v60.96,31.11
S1-5V3  (via drill 0.61)
  Top 0.254: IC7.5 45.72,25.72 43.18,23.18 v43.18,19.21 | v43.18,14.61 43.18,13.65 45.24,11.59 J4.1
  Bottom 0.254: v43.18,14.61 v43.18,19.21
S1-5V4  (via drill 0.61)
  Top 0.254: IC3.12 58.42,33.81 v57.31,34.92 | v43.18,29.84 43.81,29.21 43.81,24.61 41.91,22.7 v41.91,19.37 | v37.78,15.24 37.78,8.57 J4.6
  Bottom 0.254: v57.31,34.92 56.36,33.97 47.31,33.97 v43.18,29.84 | v37.78,15.24 v41.91,19.37
S1-5V5
  Top 0.254: IC7.10 45.72,32.38 52.39,25.72 52.39,12.06 57.63,6.83 64.77,6.83 65.88,7.94 65.88,11.27 65.72,11.43 J3.1
SCK  (via drill 0.61)
  Top 0.254: v73.03,34.13 v76.52,34.13 | v55.88,48.74 55.88,58.42 50.88,63.42 | 50.88,63.42 50.8,63.5 50.8,73.03 51.44,73.66 53.34,73.66 J1.23 | v50.8,63.34 50.88,63.42
  Bottom 0.254: IC2.13 77.63,34.13 v76.52,34.13 | v73.03,34.13 73.03,42.86 61.75,42.86 v55.88,48.74 | JP4.3 6.03,59.37 46.83,59.37 v50.8,63.34
SCL  (via drill 0.61)
  Top 0.254: v29.84,57.31 31.11,58.58 U$2.6 | v23.97,58.42 22.7,59.69 R16.2
  Bottom 0.254: v29.84,57.31 28.73,58.42 v23.97,58.42
SDA
  Top 0.254: U$2.5 32.38,61.44 30.32,63.5 R15.2
SQ  (via drill 0.61)
  Top 0.254: v29.84,60.33 U$2.7 | v16.67,60.33 15.56,60.33 15.24,60.01 R11.1
  Bottom 0.254: v16.67,60.33 v29.84,60.33
TX
  Bottom 0.254: JP3.1 92.71,49.53 92.71,71.28 90.17,73.82 90.17,76.2 35.56,76.2 J1.8